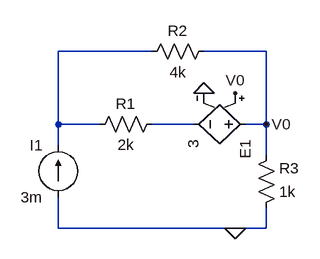
[diagram p0: schematic Draft26.asc]
Draft26.asc, the LTspice schematic file:
Version 4
SHEET 1 880 680
WIRE 192 64 48 64
WIRE 368 64 272 64
WIRE 48 176 48 64
WIRE 112 176 48 176
WIRE 256 176 192 176
WIRE 368 176 368 64
WIRE 368 176 336 176
WIRE 48 208 48 176
WIRE 368 224 368 176
WIRE 48 336 48 288
WIRE 320 336 48 336
WIRE 368 336 368 304
WIRE 368 336 320 336
FLAG 320 336 0
FLAG 368 176 V0
FLAG 320 128 V0
FLAG 272 128 0
SYMBOL current 48 288 R180
WINDOW 0 24 80 Left 2
WINDOW 3 24 0 Left 2
SYMATTR InstName I1
SYMATTR Value 3m
SYMBOL res 208 160 R90
WINDOW 0 0 56 VBottom 2
WINDOW 3 32 56 VTop 2
SYMATTR InstName R1
SYMATTR Value 2k
SYMBOL res 288 48 R90
WINDOW 0 0 56 VBottom 2
WINDOW 3 32 56 VTop 2
SYMATTR InstName R2
SYMATTR Value 4k
SYMBOL res 352 320 M180
WINDOW 0 36 76 Left 2
WINDOW 3 36 40 Left 2
SYMATTR InstName R3
SYMATTR Value 1k
SYMBOL e 352 176 R90
SYMATTR InstName E1
SYMATTR Value 3

The netlist it stands for:
* Draft26.asc
I1 0 N001 3m
R1 N002 N001 2k
R2 V0 N001 4k
R3 0 V0 1k
E1 V0 N002 V0 0 3
.backanno
.end